# Altium schematic sheet SunS_1v225_Reference.SchDoc: 2.0V Reference
size A4
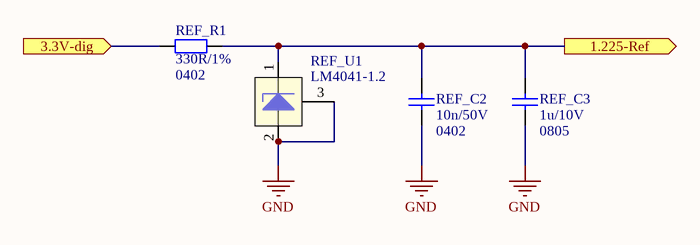
[diagram p0: SunS_1v225_Reference.SchDoc]

## Parts
REF_C2  Package: 0402  [SMD_Capacitor_0402]  (hidden comment: 10n/50V)
REF_C3  value 1u/10V  Package: 0805  [SMD_Capacitor_0805]  (hidden comment: Cap)
REF_R1  Package: 0402  [SMD_Resistor_0402]  (hidden comment: 330R/1%)
REF_U1  LM4041-1.2  [SOT23-3]

## Ports
1.225-Ref (out), 3.3V-dig (in)

## Nets
GND: REF_C2.2 REF_C3.2 REF_U1.2(A) REF_U1.3(NC)
1.225-Ref: REF_C2.1 REF_C3.1 REF_R1.2 REF_U1.1(K) ; port 1.225-Ref
3.3V-dig: REF_R1.1 ; port 3.3V-dig

## Notes on the sheet
- Title:
- Project:
- Author:
- Model:
- Document Number:
- Checked by:
- Rev:
- Date:
- Approved by:
- Sheet:
- of
- File name:

## Library data of the parts
REF_C2 = Cer_C0402T103K5RALTU: Ceramic Cap Kemet COTS 10n/50V X7R 0402; ManufacturerPartNumber: C0402T103K5RALTU; Manufacturer: Kemet; Value: 10n/50V
REF_R1 = CRCW04021K00FKxxxx: 1k/1% Vishay CRCW 0402 Resistor. 63mW, 100ppm, 50V.; Manufacturer: Vishay; ManufacturerPartNumber: CRCW04021K00FKxxxx; Value: 330R/1%
REF_U1 = LM4041AIM3X-1.2/NOPB: Shunt FIXED V-REF, 1.225V; Manufacturer: Texas Instruments; ManufacturerPartNumber: LM4041AIM3X-1.2/NOPB; HelpURL: http://www.ti.com/lit/ds/symlink/lm4041c.pdf; Value: LM4041-1.2